# EAGLE design YPORT+_Oberteil (EAGLE 7.5.0)
Assembly variants: <unbenannt>
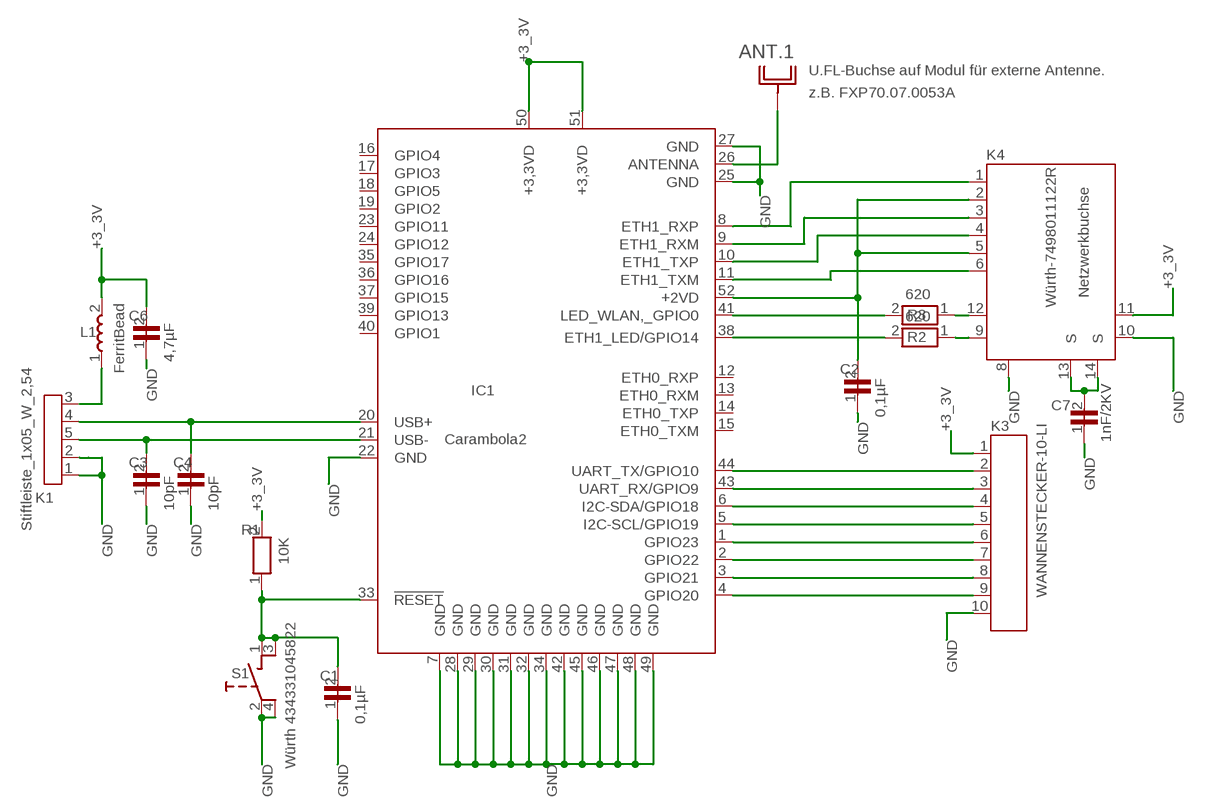
[diagram p0: schematic, sheet 1]

## Parts
ANT.1  Antennensteckdose  ANTENNENSTECKDOSE  (no package)
C1  0,1µF  [0603_KLEIN]
C2  0,1µF  [0603_KLEIN]
C3  10pF  10PF  [0603_KLEIN]
C4  10pF  10PF  [0603_KLEIN]
C6  4,7µF  [0603_KLEIN]
C7  1nF/2KV  1NF/2KV  [1206]
IC1  Carambola2  CARAMBOLA2  [CARAMBOLA2]
K1  Stiftleiste_1x05_W_2,54  STIFTLEISTE_1X05_W_2,54  [STIFTLEISTE_1X05_G_2,54]
K3  WANNENSTECKER-10-LI  [WANNENSTECKER-10-LI]
K4  Würth-7498011122R  WÜRTH-7498011122R  [WÜRTH-7498011122R]
L1  FerritBead  FERRITBEAD  [0805_KLEIN]
R1  10K  [0603_KLEIN]
R2  620  [0603_KLEIN]
R3  620  [0603_KLEIN]
S1  Würth 434331045822  WÜRTH_434331045822  [PTVF-TASTER]

## Nets
1: K4.12 R3.1
2: C3.2 IC1.21(USB-) K1.5
3: C4.2 IC1.20(USB+) K1.4
4: K1.3 L1.1
+2VD: C2.2 IC1.52(+2VD) K4.2 K4.5
+3_3V: C6.2 IC1.50(+3,3VD) IC1.51(+3,3VD) K3.1 K4.11 L1.2 R1.2
ANTENNA: ANT.1.1 IC1.26(ANTENNA)
ETH1_RXM: IC1.9(ETH1_RXM) K4.3
ETH1_RXP: IC1.8(ETH1_RXP) K4.1
ETH1_TXM: IC1.11(ETH1_TXM) K4.6
ETH1_TXP: IC1.10(ETH1_TXP) K4.4
GND: C1.1 C2.1 C3.1 C4.1 C6.1 C7.1 IC1.7(GND) IC1.22(GND) IC1.25(GND) IC1.27(GND) IC1.28(GND) IC1.29(GND) IC1.30(GND) IC1.31(GND) IC1.32(GND) IC1.34(GND) IC1.42(GND) IC1.45(GND) IC1.46(GND) IC1.47(GND) IC1.48(GND) IC1.49(GND) K1.1 K1.2 K3.10 K4.8 K4.10 S1.2 S1.4
GPIO14: IC1.41(LED_WLAN,_GPIO0) R3.2
GPIO20: IC1.4(GPIO20) K3.9
GPIO21: IC1.3(GPIO21) K3.8
GPIO22: IC1.2(GPIO22) K3.7
GPIO23: IC1.1(GPIO23) K3.6
I2C/GPIO19: IC1.5(I2C-SCL/GPIO19) K3.5
SIG$5: C1.2 IC1.33(!RESET) R1.1 S1.1 S1.3
SIG$12: IC1.38(ETH1_LED/GPIO14) R2.2
SIG$15: IC1.6(I2C-SDA/GPIO18) K3.4
SIG$17: C7.2 K4.13(S) K4.14(S)
SIG$19: K4.9 R2.1
UART_RX/GPIO9: IC1.43(UART_RX/GPIO9) K3.3
UART_TX/GPIO10: IC1.44(UART_TX/GPIO10) K3.2
Unconnected: IC1.12(ETH0_RXP) IC1.13(ETH0_RXM) IC1.14(ETH0_TXP) IC1.15(ETH0_TXM) IC1.16(GPIO4) IC1.17(GPIO3) IC1.18(GPIO5) IC1.19(GPIO2) IC1.23(GPIO11) IC1.24(GPIO12) IC1.35(GPIO17) IC1.36(GPIO16) IC1.37(GPIO15) IC1.39(GPIO13) IC1.40(GPIO1)

## Notes on the sheet
- U.FL-Buchse auf Modul für externe Antenne.
- z.B. FXP70.07.0053A
- Netzwerkbuchse

## Library data of the parts
ANT.1 = TARGET3001!_V31.8.0.48:ANTENNENSTECKDOSE: Antennensteckdose
C1 C2 = TARGET3001!_V31.8.0.48:0,1µF
C3 C4 = TARGET3001!_V31.8.0.48:10PF
C6 = TARGET3001!_V31.8.0.48:4,7µF
C7 = TARGET3001!_V31.8.0.48:1NF/2KV: SMD VS KONDENSATOR 0.1 UF 1206 50 V SMD-Vielschicht-Keramik-Kondensatoren Nennspannung 50 V - 1 pF - 1000 pF NPO; 1200 pF -1 µF X7R. Toleranz 1 pF ... 1000 pF: 5%; 1200 pF ... 1 µF: ±10%. Baugröße 1206 ; Wert 0,1 µ
IC1 = TARGET3001!_V31.8.0.48:CARAMBOLA2
K1 = TARGET3001!_V31.8.0.48:STIFTLEISTE_1X05_W_2,54: Stiftleiste
K3 = TARGET3001!_V31.8.0.48:WANNENSTECKER-10-LI: Wannenstecker für abgewinkelte Print-Montage 2x5-polig
K4 = TARGET3001!_V31.8.0.48:WÜRTH-7498011122R
L1 = TARGET3001!_V31.8.0.48:FERRITBEAD: Miniatur Festinduktivität 10µH, R=0,55
R1 = TARGET3001!_V31.8.0.48:10K: Widerstand, allgemein
R2 R3 = TARGET3001!_V31.8.0.48:620: Widerstand, allgemein
S1 = TARGET3001!_V31.8.0.48:WÜRTH_434331045822: KURZHUBTAST. -vertikkaler EINBAU Kurzhubtaster für Durchsteckmontage Technische Daten: Schaltleistung: 50 mA/12 V= - Übergangswiderstand: 100 mOhm max. - Isolationswiderstand: 100 MOhm min. - Spannungsfestigkeit: 250 V~ min. (1 Minute) - Elektrische Lebensdauer (Zyklen): 100.000 - Horizontaler Einbau - Betätigungskraft: 1,6 N ±0,5 N/Hub 0,25 mm - Arbeitstemp. -20 bis +70 °C - Lagertemp. -30 bis +80 °C - Vibrationen: 10 - 500 Hz/10 g - Schwallbadlötung: 255 °C, 5 sec. max. - Handlötung: 300 °C, 3 sec. max. - Ausführung: Drucktaster - Polzahl: einpolig. APEM Nr. PHAP3305A ; Schaltstellung AUS - TAST (EIN) ; Abm. (L) 3,85 m

## Board
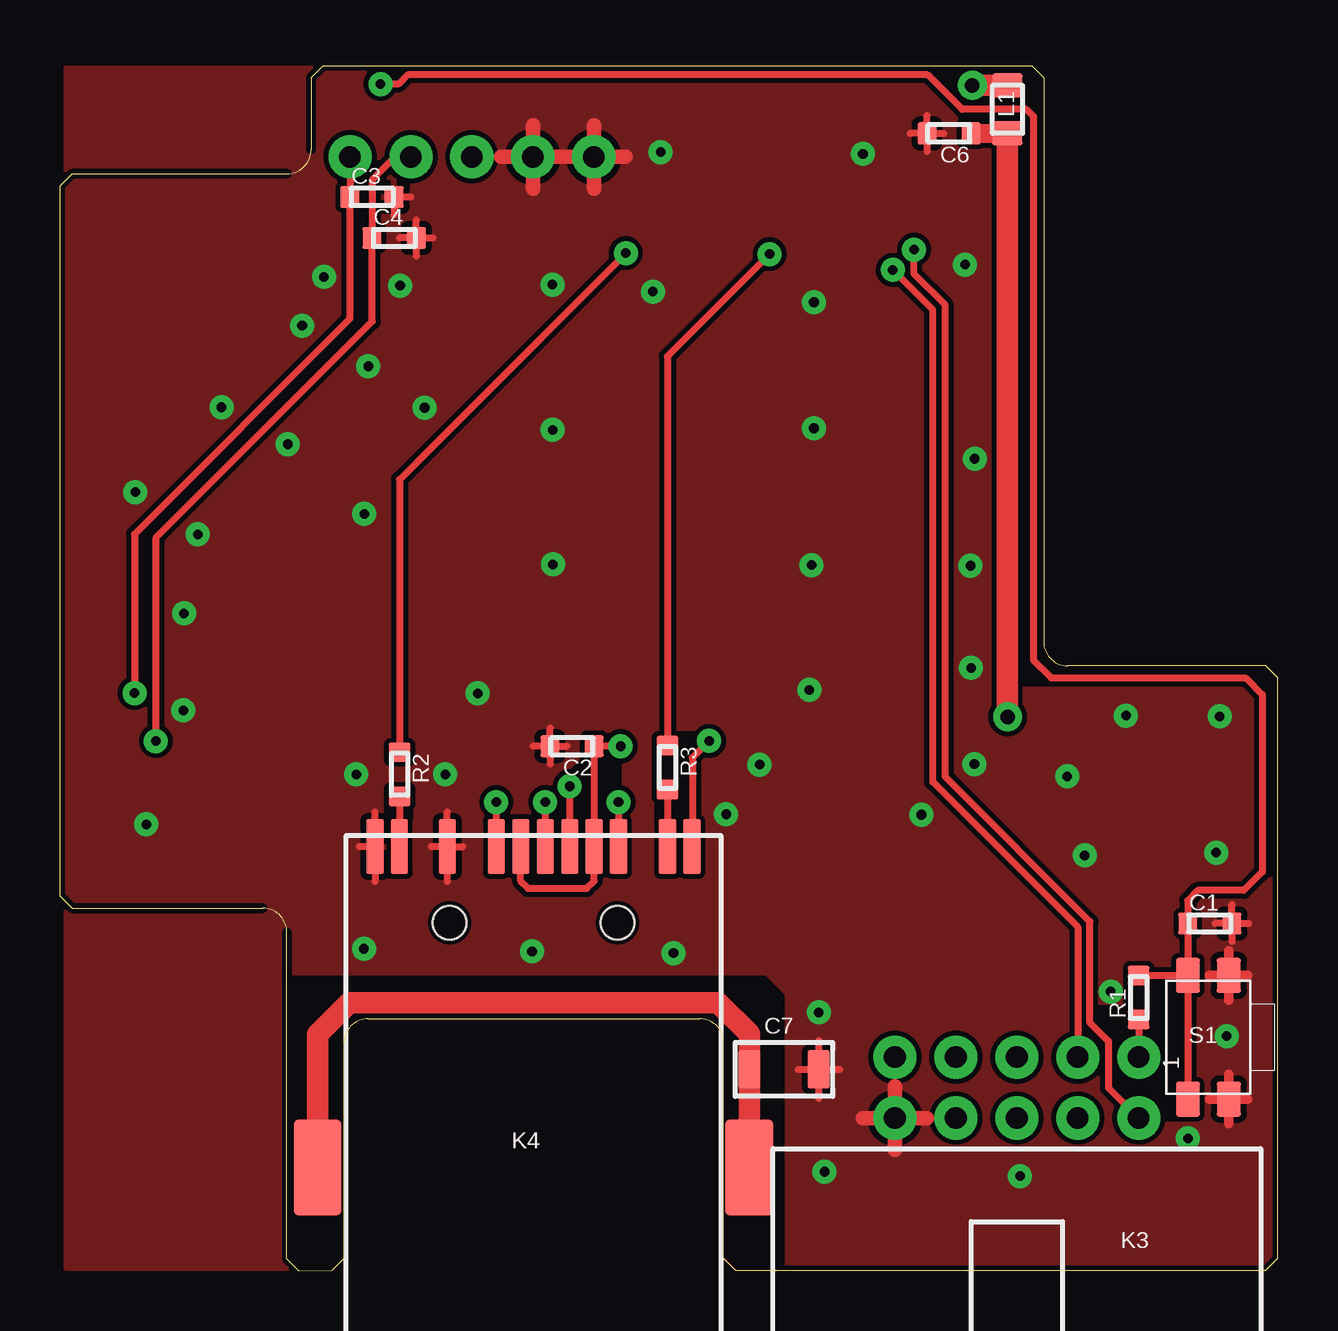
[diagram p1: board, top side]
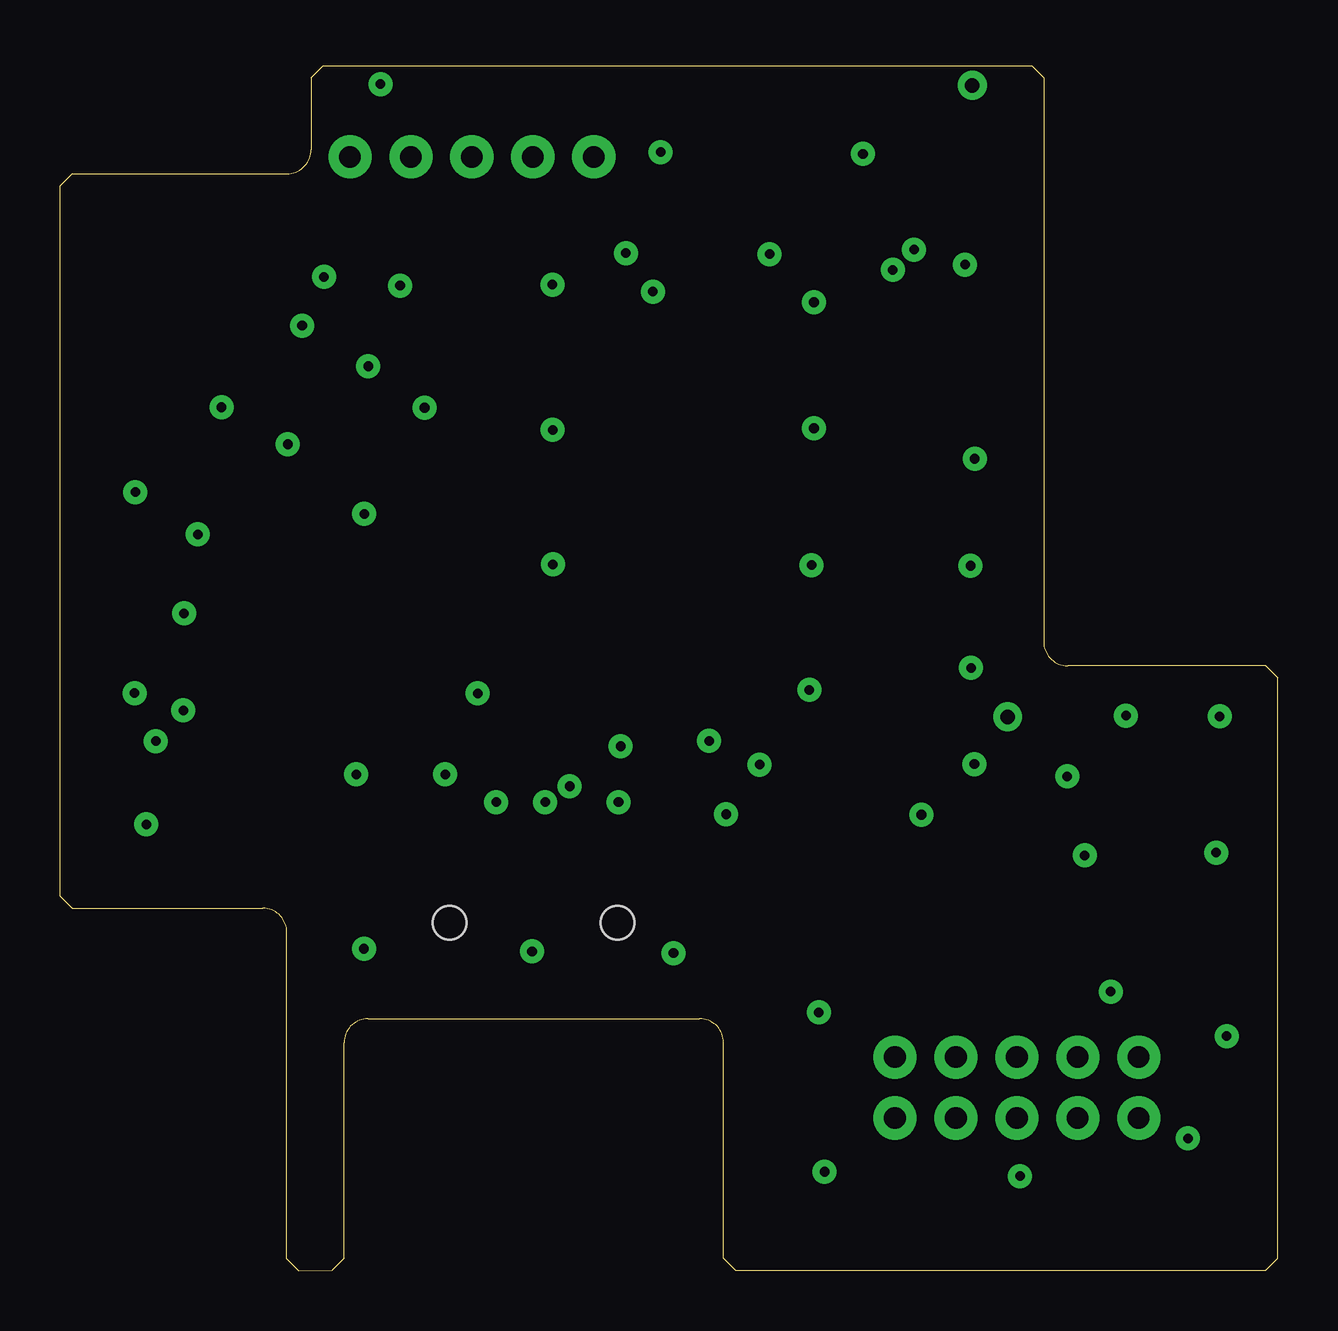
[diagram p2: board, inner layer 2]
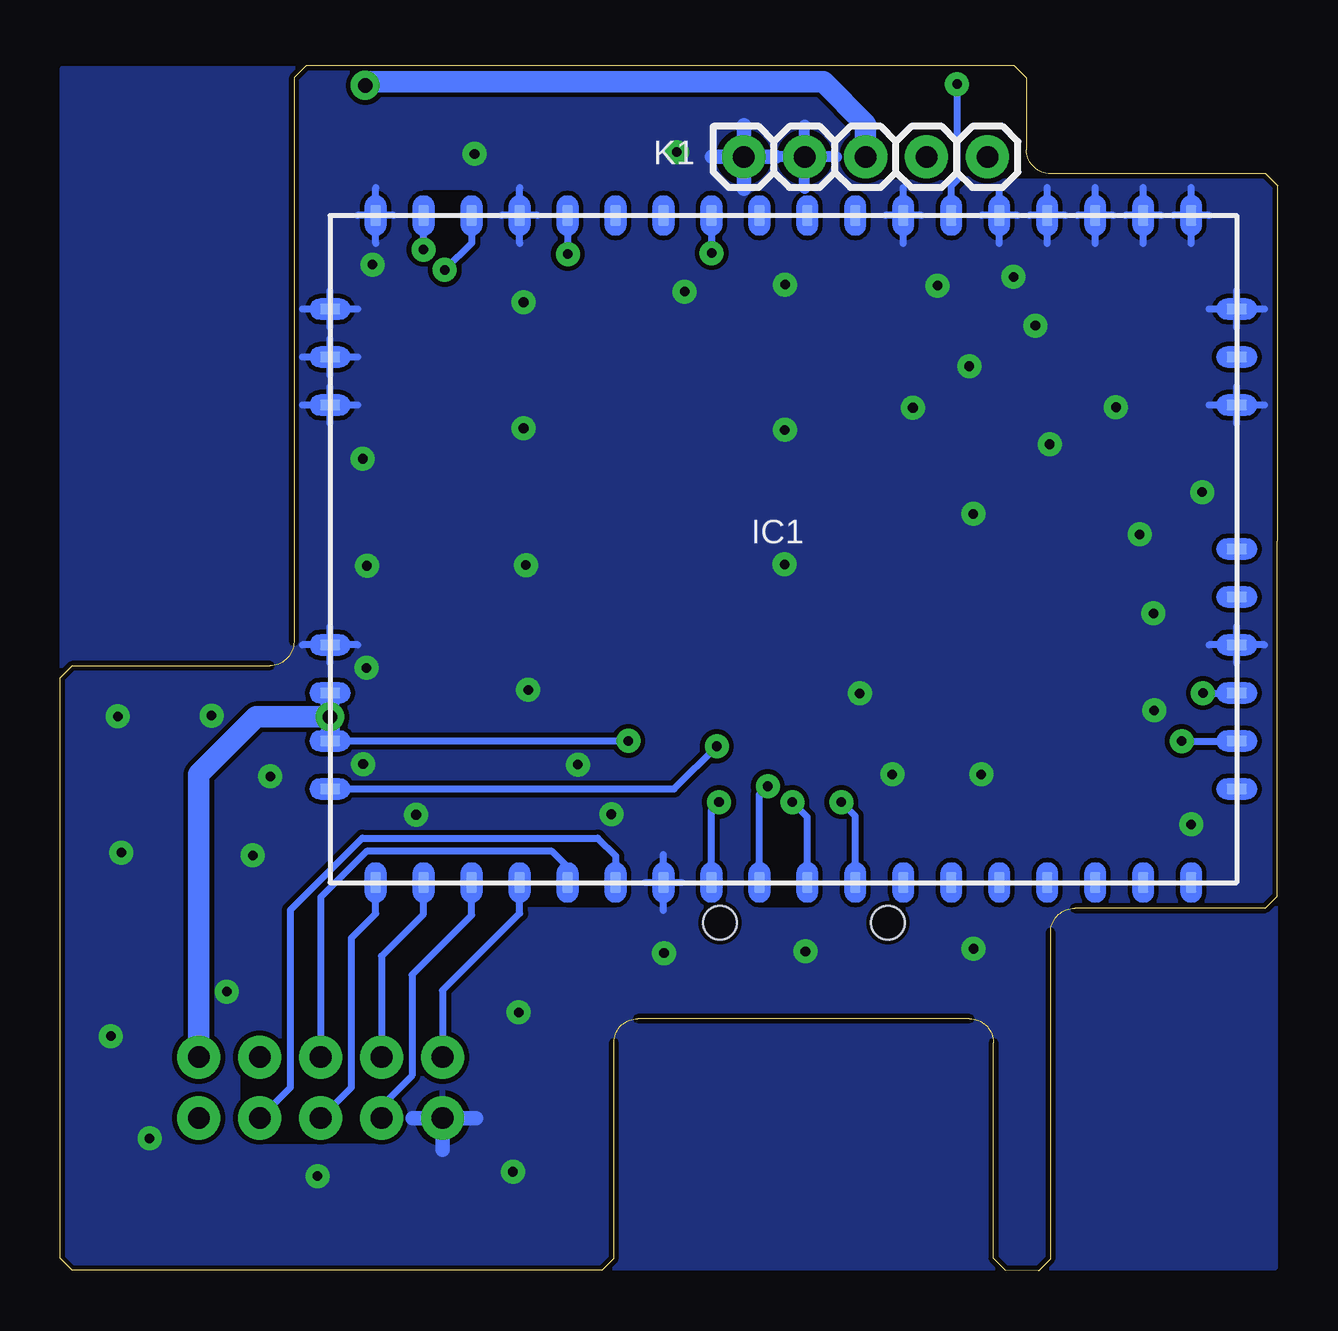
[diagram p3: board, bottom side, seen from below]

Size 50.75 x 50.21 mm. Coordinates in mm from the lower left corner, seen from the top.
Outline: 50.75,0.51 50.75,24.71 50.25,25.21 42,25.21 arc-90 41,26.21 41,49.71 40.5,50.21 10.96,50.21 10.46,49.71 10.46,46.71 arc-90 9.46,45.71 0.5,45.71 0,45.21 0.01,15.61 0.51,15.1 8.46,15.1 arc-90 9.46,14.1 9.46,0.49 9.95,0 11.34,0.01 11.84,0.51 11.84,9.5 arc-90 12.84,10.5 26.66,10.5 arc-90 27.66,9.5 27.66,0.51 28.16,0.01 50.25,0.01 50.75,0.51
Copper layers (1*16): Top 0.035mm / dielectric 1.5mm / Bottom 0.035mm
Design rules "TARGET3001!": minimum track width 0.2mm, minimum drill 0.4mm, track to track 0.2mm, track to pad 0.2mm, pad to pad 0.2mm, via to via 0.2mm, smd to smd 0.2mm, copper to edge 0mm, drill to drill 0.3mm, minimum pad ring 0.45mm, minimum via ring 0.3mm, stop-mask expansion 4mil, vias tented up to drill 0mil, thermal gap 10mil

### Footprints (pad centres in the part's own frame; a part is rotated, then mirrored left to right if it is on the bottom)
0603_KLEIN = smd 0.8 x 0.9: 1 -0.917,0; 2 0.917,0
1206 = smd 0.9 x 1.6: 1 -1.45,0; 2 1.45,0
CARAMBOLA2 = smd 0.85 x 0.45: 1 0,0; 2 0,-1.999; 3 0,-4.001; 4 0,-6; 5 0,-8.001; 6 0,-10; 7 0,-11.999; 8 0,-14.001; 9 0,-15.999; 10 0,-17.996; 11 0,-19.995; 12 0,-21.996; 13 0,-23.995; 14 0,-25.997; 15 0,-27.996; 16 0,-29.995; 17 0,-31.996; 18 0,-33.995; 28 27.795,-33.995; 29 27.795,-31.996; 30 27.795,-29.995; 31 27.795,-27.996; 32 27.795,-25.997; 33 27.795,-23.995; 34 27.795,-21.996; 35 27.795,-19.995; 36 27.795,-17.996; 37 27.795,-15.999; 38 27.795,-14.001; 39 27.795,-11.999; 40 27.795,-10; 41 27.795,-8.001; 42 27.795,-6; 43 27.795,-4.001; 44 27.795,-1.999; 45 27.795,0 | smd 0.45 x 0.85: 19 3.901,-35.895; 20 5.9,-35.895; 21 7.899,-35.895; 22 9.901,-35.895; 23 11.9,-35.895; 24 13.899,-35.895; 25 19.896,-35.895; 26 21.897,-35.895; 27 23.896,-35.895; 46 23.896,1.9; 47 21.897,1.9; 48 19.896,1.9; 49 9.901,1.9; 50 7.899,1.9; 51 5.9,1.9; 52 3.901,1.9
STIFTLEISTE_1X05_G_2,54 = drill 0.9 pad 1.8 round: 1 0,0; 2 2.54,0; 3 5.08,0; 4 7.62,0; 5 10.16,0
WANNENSTECKER-10-LI = drill 0.9 pad 1.8 round: 1 -5.08,-1.27; 2 -5.08,1.27; 3 -2.54,-1.27; 4 -2.54,1.27; 5 0,-1.27; 6 0,1.27; 7 2.54,-1.27; 8 2.54,1.27; 9 5.08,-1.27; 10 5.08,1.27
WÜRTH-7498011122R = smd 0.71 x 2.29: 1 3.545,8.17; 2 2.525,8.17; 3 1.505,8.17; 4 0.485,8.17; 5 -0.535,8.17; 6 -1.555,8.17; 8 -3.595,8.17; 9 -5.585,8.17; 10 -6.605,8.17; 11 6.605,8.17; 12 5.585,8.17 | smd 2 x 4: 13 8.989,-5.21; 14 -8.998,-5.21 | hole 1.4: 3.5,4.99; -3.5,4.99
0805_KLEIN = smd 1 x 1.25: 1 1,0; 2 -1,0
PTVF-TASTER = smd 1.45 x 1: 1 -2.575,2.6; 2 -2.575,0.9; 3 2.575,2.6; 4 2.575,0.9

### Placement (x,y rotation side)
C1  47.93,14.46 180 top
C2  21.34,21.85 0 top
C3  13.01,44.74 180 top
C4  13.93,43.03 180 top
C6  37.06,47.38 0 top
C7  30.18,8.38 180 top
IC1  37.59,16.17 90 bottom
K1  22.25,46.41 0 bottom
K3  39.88,7.62 180 top
K4  19.74,9.5 0 top
L1  39.49,48.38 90 top
R1  44.96,11.38 270 top
R2  14.15,20.68 90 top
R3  25.32,20.96 90 top
S1  49.61,9.72 90 top

### Tracks (layer width: path | path; a pad name or v marks a point on that pad's centre or on a via)
1
  Top 0.3: R3.1 K4.12
2  (via drill 0.4 pad 1)
  Top 0.3: C3.2 | C3.2 12.09,39.67 3.11,30.69 v3.11,24.07 | K1.5 C3.2
  Bottom 0.3: v3.11,24.07 IC1.21
3  (via drill 0.4 pad 1)
  Top 0.3: v3.99,22.06 3.99,30.53 13.01,39.55 C4.2 13.01,45.45 13.97,46.41 K1.4
  Bottom 0.3: v3.99,22.06 IC1.20
4  (via drill 0.6 pad 1.2)
  Top 0.9: v38.03,49.38 L1.1
  Bottom 0.9: K1.3 17.17,47.77 18.94,49.54 37.87,49.54 v38.03,49.38
+2VD  (via drill 0.4 pad 1)
  Top 0.3: C2.2 | K4.5 19.2,16.23 19.51,15.92 21.96,15.92 22.26,16.23 K4.2 C2.2 v23.37,21.85 v23.36,21.85 | C2.2
  Bottom 0.3: IC1.52 25.15,20.07 v23.37,21.85 23.28,21.75
+3_3V  (via drill 0.4 pad 1, 0.6 pad 1.2)
  Top 0.3: R1.2 K3.1 | v27.06,22.07 26.36,21.38 26.36,17.69 26.35,17.69
  Top 0.8: C6.2 L1.2
  Top 0.9: v39.5,23.07 L1.2
  Top 1: L1.2
  Bottom 0.3: IC1.51 v27.06,22.07
  Bottom 0.8: IC1.50 v39.5,23.07 IC1.51
  Bottom 0.9: v39.5,23.07 42.57,23.07 44.96,20.68 K3.1
ANTENNA
  cutout Top: 3.1,-14.49 3.09,-14.49 3.08,-14.49 3.08,-14.5 3.08,-14.51 3.09,-14.51 3.1,-14.52 3.11,-14.51 3.11,-14.51 3.11,-14.5
  cutout Top: 29.39,12.27 29.4,12.27 29.4,12.28 29.4,12.29 29.39,12.29 9.25,12.29 9.24,12.29 9.24,12.28 9.24,12.27 9.25,12.27
  cutout Top: 29.4,12.29 29.39,12.29 29.38,12.29 29.38,12.28 29.38,12.27 30.18,11.47 30.19,11.47 30.2,11.47 30.2,11.48 30.2,11.49
  cutout Top: 30.18,0.14 30.18,0.13 30.19,0.12 30.2,0.13 30.2,0.14 30.2,11.48 30.2,11.49 30.19,11.49 30.18,11.49 30.18,11.48
  cutout Bottom: 15,45.49 15,45.49 14.99,45.48 15,45.47 15,45.46 16.65,45.46 16.66,45.47 16.66,45.48 16.66,45.49 16.65,45.49
  cutout Bottom: 35.59,44.99 35.6,45 35.6,45 35.6,45.01 35.59,45.02 33.6,45.02 33.59,45.01 33.59,45 33.59,45 33.6,44.99
  cutout Bottom: 35.6,45 35.61,45.01 35.6,45.02 35.59,45.02 35.59,45.02 35.58,45.01 35.58,45 35.58,45 35.59,44.99 35.6,45
  cutout Bottom: 43.2,6.78 43.2,6.77 43.21,6.77 43.22,6.77 43.22,6.78 43.22,8.34 43.22,8.35 43.21,8.35 43.2,8.35 43.2,8.34
  cutout Bottom: 43.2,6.78 43.19,6.77 43.2,6.77 43.2,6.76 43.21,6.77 43.22,6.77 43.22,6.78 43.22,6.79 43.21,6.79 43.2,6.79
  cutout Bottom: 31.46,15.16 31.47,15.16 31.48,15.17 31.47,15.18 31.46,15.18 29.61,15.18 29.6,15.18 29.6,15.17 29.6,15.16 29.61,15.16
  cutout Bottom: 31.47,15.14 31.48,15.14 31.49,15.14 31.49,15.15 31.49,15.16 31.47,15.18 31.46,15.18 31.46,15.18 31.45,15.17 31.46,15.16
  cutout Bottom: 29.6,15.14 29.61,15.14 29.62,15.15 29.61,15.16 29.6,15.16 27.6,15.16 27.59,15.16 27.59,15.15 27.59,15.14 27.6,15.14
  cutout Bottom: 29.62,15.15 29.62,15.16 29.62,15.17 29.61,15.17 29.6,15.17 29.6,15.16 29.59,15.15 29.6,15.14 29.6,15.14 29.61,15.14
  cutout Top: 26.55,22.45 26.55,22.45 26.56,22.46 26.55,22.47 26.55,22.48 25.83,22.48 25.82,22.47 25.82,22.46 25.82,22.45 25.83,22.45
  cutout Top: 24.68,20.48 24.68,20.47 24.69,20.47 24.7,20.47 24.7,20.48 24.7,21.43 24.7,21.44 24.69,21.44 24.68,21.44 24.68,21.43
  cutout Top: 21.67,21.26 21.67,21.25 21.68,21.24 21.69,21.25 21.69,21.26 21.69,21.37 21.69,21.37 21.68,21.38 21.67,21.37 21.67,21.37
  cutout Top: 21.27,20.86 21.27,20.86 21.27,20.85 21.28,20.84 21.29,20.85 21.69,21.25 21.69,21.26 21.69,21.26 21.68,21.27 21.67,21.26
  cutout Top: 13.51,18.95 13.51,18.94 13.52,18.94 13.53,18.94 13.53,18.95 13.53,19.31 13.53,19.32 13.52,19.33 13.51,19.32 13.51,19.31
  cutout Top: 24.8,19.5 24.79,19.51 24.78,19.52 24.78,19.51 24.77,19.5 24.77,18.87 24.78,18.86 24.78,18.85 24.79,18.86 24.8,18.87
  cutout Top: 24.8,19.5 24.79,19.51 24.78,19.52 24.78,19.51 24.77,19.5 24.78,19.49 24.78,19.49 24.79,19.49
  cutout Top: 23.37,20.12 23.38,20.11 23.39,20.11 23.39,20.11 23.4,20.12 23.4,21.2 23.39,21.21 23.39,21.22 23.38,21.21 23.37,21.2
  cutout Top: 23.4,20.12 23.39,20.13 23.39,20.13 23.38,20.13 23.37,20.12 23.38,20.11 23.39,20.11 23.39,20.11
  cutout Top: 40.05,24.37 40.04,24.37 40.03,24.36 40.04,24.35 40.05,24.35 41.42,24.35 41.42,24.35 41.43,24.36 41.42,24.37 41.42,24.37
  cutout Top: 40.02,24.4 40.02,24.4 40.01,24.4 40,24.39 40.01,24.38 40.04,24.35 40.05,24.35 40.05,24.35 40.06,24.36 40.05,24.37
  cutout Top: 45.95,6.26 45.94,6.27 45.93,6.26 45.93,6.25 45.93,6.24 45.95,6.23 45.96,6.22 45.96,6.23 45.97,6.24 45.96,6.24
  cutout Top: 37.68,8.03 37.67,8.04 37.66,8.03 37.66,8.03 37.66,8.02 37.69,7.98 37.7,7.98 37.71,7.98 37.71,7.99 37.71,8
  cutout Bottom: 9.55,45.54 9.55,45.54 9.54,45.53 9.55,45.52 9.55,45.52 11.55,45.52 11.55,45.52 11.56,45.53 11.55,45.54 11.55,45.54
  cutout Bottom: 9.56,45.54 9.55,45.55 9.54,45.54 9.54,45.53 9.54,45.53 9.55,45.52 9.55,45.52 9.56,45.52 9.57,45.53 9.56,45.54
  cutout Bottom: 21.59,15.15 21.6,15.15 21.6,15.16 21.6,15.17 21.59,15.17 19.61,15.17 19.6,15.17 19.6,15.16 19.6,15.15 19.61,15.15
  cutout Bottom: 21.61,15.16 21.61,15.17 21.61,15.18 21.6,15.18 21.59,15.18 21.58,15.17 21.58,15.16 21.58,15.15 21.59,15.15 21.6,15.15
  cutout Bottom: 39.83,5.3 39.84,5.3 39.84,5.31 39.84,5.32 39.83,5.32 37.28,5.32 37.27,5.32 37.27,5.31 37.27,5.3 37.28,5.3
  cutout Bottom: 39.85,5.31 39.86,5.32 39.85,5.33 39.84,5.33 39.83,5.33 39.82,5.32 39.82,5.31 39.82,5.3 39.83,5.3 39.84,5.3
  cutout Bottom: 42.38,5.29 42.39,5.29 42.4,5.3 42.39,5.31 42.38,5.31 39.8,5.31 39.79,5.31 39.79,5.3 39.79,5.29 39.8,5.29
  cutout Bottom: 42.39,5.28 42.4,5.27 42.4,5.28 42.41,5.29 42.4,5.3 42.39,5.31 42.38,5.31 42.38,5.31 42.37,5.3 42.38,5.29
  cutout Top: 43.16,11.05 43.15,11.05 43.15,11.04 43.15,11.03 43.16,11.03 44.39,11.03 44.4,11.03 44.4,11.04 44.4,11.05 44.39,11.05
  cutout Top: 46.82,6.23 46.83,6.23 46.83,6.24 46.83,6.25 46.82,6.25 45.82,6.25 45.81,6.25 45.81,6.24 45.81,6.23 45.82,6.23
  cutout Top: 44.35,11.92 44.34,11.93 44.34,11.93 44.33,11.93 44.32,11.92 44.32,10.94 44.33,10.94 44.34,10.93 44.34,10.94 44.35,10.94
  cutout Top: 14.71,19.3 14.71,19.31 14.7,19.31 14.69,19.31 14.69,19.3 14.69,18.88 14.69,18.87 14.7,18.87 14.71,18.87 14.71,18.88
  cutout Bottom: 50.95,24.71 50.89,24.85 50.75,24.91 50.61,24.85 50.55,24.71 50.55,0.51 50.61,0.36 50.75,0.31 50.89,0.36 50.95,0.51
  cutout layer 2: 50.95,24.71 50.89,24.85 50.75,24.91 50.61,24.85 50.55,24.71 50.55,0.51 50.61,0.36 50.75,0.31 50.89,0.36 50.95,0.51
  cutout layer 2: 50.95,24.71 50.89,24.85 50.75,24.91 50.61,24.85 50.55,24.71 50.55,0.51 50.61,0.36 50.75,0.31 50.89,0.36 50.95,0.51
  cutout Top: 50.95,24.71 50.89,24.85 50.75,24.91 50.61,24.85 50.55,24.71 50.55,0.51 50.61,0.36 50.75,0.31 50.89,0.36 50.95,0.51
  cutout Bottom: 42,25.41 41.86,25.35 41.8,25.21 41.86,25.07 42,25.01 50.25,25.01 50.39,25.07 50.45,25.21 50.39,25.35 50.25,25.41
  cutout layer 2: 42,25.41 41.86,25.35 41.8,25.21 41.86,25.07 42,25.01 50.25,25.01 50.39,25.07 50.45,25.21 50.39,25.35 50.25,25.41
  cutout layer 2: 42,25.41 41.86,25.35 41.8,25.21 41.86,25.07 42,25.01 50.25,25.01 50.39,25.07 50.45,25.21 50.39,25.35 50.25,25.41
  cutout Top: 42,25.41 41.86,25.35 41.8,25.21 41.86,25.07 42,25.01 50.25,25.01 50.39,25.07 50.45,25.21 50.39,25.35 50.25,25.41
  cutout Bottom: 40.8,26.21 40.86,26.07 41,26.01 41.14,26.07 41.2,26.21 41.2,49.71 41.14,49.85 41,49.91 40.86,49.85 40.8,49.71
  cutout layer 2: 40.8,26.21 40.86,26.07 41,26.01 41.14,26.07 41.2,26.21 41.2,49.71 41.14,49.85 41,49.91 40.86,49.85 40.8,49.71
  cutout layer 2: 40.8,26.21 40.86,26.07 41,26.01 41.14,26.07 41.2,26.21 41.2,49.71 41.14,49.85 41,49.91 40.86,49.85 40.8,49.71
  cutout Top: 40.8,26.21 40.86,26.07 41,26.01 41.14,26.07 41.2,26.21 41.2,49.71 41.14,49.85 41,49.91 40.86,49.85 40.8,49.71
  cutout Bottom: 40.5,50.01 40.64,50.06 40.7,50.21 40.64,50.35 40.5,50.41 10.96,50.41 10.82,50.35 10.76,50.21 10.82,50.06 10.96,50.01
  cutout layer 2: 40.5,50.01 40.64,50.06 40.7,50.21 40.64,50.35 40.5,50.41 10.96,50.41 10.82,50.35 10.76,50.21 10.82,50.06 10.96,50.01
  cutout layer 2: 40.5,50.01 40.64,50.06 40.7,50.21 40.64,50.35 40.5,50.41 10.96,50.41 10.82,50.35 10.76,50.21 10.82,50.06 10.96,50.01
  cutout Top: 40.5,50.01 40.64,50.06 40.7,50.21 40.64,50.35 40.5,50.41 10.96,50.41 10.82,50.35 10.76,50.21 10.82,50.06 10.96,50.01
  cutout Bottom: 10.26,46.71 10.32,46.56 10.46,46.51 10.61,46.56 10.66,46.71 10.66,49.71 10.61,49.85 10.46,49.91 10.32,49.85 10.26,49.71
  cutout layer 2: 10.26,46.71 10.32,46.56 10.46,46.51 10.61,46.56 10.66,46.71 10.66,49.71 10.61,49.85 10.46,49.91 10.32,49.85 10.26,49.71
  cutout layer 2: 10.26,46.71 10.32,46.56 10.46,46.51 10.61,46.56 10.66,46.71 10.66,49.71 10.61,49.85 10.46,49.91 10.32,49.85 10.26,49.71
  cutout Top: 10.26,46.71 10.32,46.56 10.46,46.51 10.61,46.56 10.66,46.71 10.66,49.71 10.61,49.85 10.46,49.91 10.32,49.85 10.26,49.71
  cutout Bottom: 9.46,45.51 9.61,45.56 9.66,45.71 9.61,45.85 9.46,45.91 0.5,45.91 0.36,45.85 0.3,45.71 0.36,45.56 0.5,45.51
  cutout layer 2: 9.46,45.51 9.61,45.56 9.66,45.71 9.61,45.85 9.46,45.91 0.5,45.91 0.36,45.85 0.3,45.71 0.36,45.56 0.5,45.51
  cutout layer 2: 9.46,45.51 9.61,45.56 9.66,45.71 9.61,45.85 9.46,45.91 0.5,45.91 0.36,45.85 0.3,45.71 0.36,45.56 0.5,45.51
  cutout Top: 9.46,45.51 9.61,45.56 9.66,45.71 9.61,45.85 9.46,45.91 0.5,45.91 0.36,45.85 0.3,45.71 0.36,45.56 0.5,45.51
  cutout Bottom: 0.2,45.21 0.14,45.35 0,45.41 -0.14,45.35 -0.2,45.21 -0.19,15.61 -0.13,15.46 0.01,15.41 0.15,15.47 0.21,15.61
  cutout layer 2: 0.2,45.21 0.14,45.35 0,45.41 -0.14,45.35 -0.2,45.21 -0.19,15.61 -0.13,15.46 0.01,15.41 0.15,15.47 0.21,15.61
  cutout layer 2: 0.2,45.21 0.14,45.35 0,45.41 -0.14,45.35 -0.2,45.21 -0.19,15.61 -0.13,15.46 0.01,15.41 0.15,15.47 0.21,15.61
  cutout Top: 0.2,45.21 0.14,45.35 0,45.41 -0.14,45.35 -0.2,45.21 -0.19,15.61 -0.13,15.46 0.01,15.41 0.15,15.47 0.21,15.61
  cutout Bottom: 8.46,14.9 8.6,14.96 8.66,15.1 8.6,15.24 8.46,15.3 0.51,15.3 0.37,15.24 0.31,15.1 0.37,14.96 0.51,14.9
  cutout layer 2: 8.46,14.9 8.6,14.96 8.66,15.1 8.6,15.24 8.46,15.3 0.51,15.3 0.37,15.24 0.31,15.1 0.37,14.96 0.51,14.9
  cutout layer 2: 8.46,14.9 8.6,14.96 8.66,15.1 8.6,15.24 8.46,15.3 0.51,15.3 0.37,15.24 0.31,15.1 0.37,14.96 0.51,14.9
  cutout Top: 8.46,14.9 8.6,14.96 8.66,15.1 8.6,15.24 8.46,15.3 0.51,15.3 0.37,15.24 0.31,15.1 0.37,14.96 0.51,14.9
  cutout Bottom: 9.66,14.1 9.6,14.24 9.46,14.3 9.32,14.24 9.26,14.1 9.26,0.49 9.32,0.35 9.46,0.29 9.6,0.35 9.66,0.49
  cutout layer 2: 9.66,14.1 9.6,14.24 9.46,14.3 9.32,14.24 9.26,14.1 9.26,0.49 9.32,0.35 9.46,0.29 9.6,0.35 9.66,0.49
  cutout layer 2: 9.66,14.1 9.6,14.24 9.46,14.3 9.32,14.24 9.26,14.1 9.26,0.49 9.32,0.35 9.46,0.29 9.6,0.35 9.66,0.49
  cutout Top: 9.66,14.1 9.6,14.24 9.46,14.3 9.32,14.24 9.26,14.1 9.26,0.49 9.32,0.35 9.46,0.29 9.6,0.35 9.66,0.49
  cutout Bottom: 50.89,0.37 50.95,0.51 50.89,0.65 50.75,0.71 50.61,0.65 50.11,0.15 50.05,0.01 50.11,-0.13 50.25,-0.19 50.39,-0.13
  cutout layer 2: 50.89,0.37 50.95,0.51 50.89,0.65 50.75,0.71 50.61,0.65 50.11,0.15 50.05,0.01 50.11,-0.13 50.25,-0.19 50.39,-0.13
  cutout layer 2: 50.89,0.37 50.95,0.51 50.89,0.65 50.75,0.71 50.61,0.65 50.11,0.15 50.05,0.01 50.11,-0.13 50.25,-0.19 50.39,-0.13
  cutout Top: 50.89,0.37 50.95,0.51 50.89,0.65 50.75,0.71 50.61,0.65 50.11,0.15 50.05,0.01 50.11,-0.13 50.25,-0.19 50.39,-0.13
  cutout Bottom: 9.6,0.63 9.46,0.69 9.32,0.63 9.26,0.49 9.32,0.35 9.81,-0.14 9.95,-0.2 10.09,-0.14 10.15,0 10.09,0.14
  cutout layer 2: 9.6,0.63 9.46,0.69 9.32,0.63 9.26,0.49 9.32,0.35 9.81,-0.14 9.95,-0.2 10.09,-0.14 10.15,0 10.09,0.14
  cutout layer 2: 9.6,0.63 9.46,0.69 9.32,0.63 9.26,0.49 9.32,0.35 9.81,-0.14 9.95,-0.2 10.09,-0.14 10.15,0 10.09,0.14
  cutout Top: 9.6,0.63 9.46,0.69 9.32,0.63 9.26,0.49 9.32,0.35 9.81,-0.14 9.95,-0.2 10.09,-0.14 10.15,0 10.09,0.14
  cutout Bottom: 0.15,15.75 0.01,15.81 -0.13,15.75 -0.19,15.61 -0.13,15.47 0.37,14.96 0.51,14.9 0.66,14.96 0.71,15.1 0.66,15.24
  cutout layer 2: 0.15,15.75 0.01,15.81 -0.13,15.75 -0.19,15.61 -0.13,15.47 0.37,14.96 0.51,14.9 0.66,14.96 0.71,15.1 0.66,15.24
  cutout layer 2: 0.15,15.75 0.01,15.81 -0.13,15.75 -0.19,15.61 -0.13,15.47 0.37,14.96 0.51,14.9 0.66,14.96 0.71,15.1 0.66,15.24
  cutout Top: 0.15,15.75 0.01,15.81 -0.13,15.75 -0.19,15.61 -0.13,15.47 0.37,14.96 0.51,14.9 0.66,14.96 0.71,15.1 0.66,15.24
  cutout Bottom: -0.14,45.35 -0.2,45.21 -0.14,45.07 0,45.01 0.14,45.07 0.64,45.57 0.7,45.71 0.64,45.85 0.5,45.91 0.36,45.85
  cutout layer 2: -0.14,45.35 -0.2,45.21 -0.14,45.07 0,45.01 0.14,45.07 0.64,45.57 0.7,45.71 0.64,45.85 0.5,45.91 0.36,45.85
  cutout layer 2: -0.14,45.35 -0.2,45.21 -0.14,45.07 0,45.01 0.14,45.07 0.64,45.57 0.7,45.71 0.64,45.85 0.5,45.91 0.36,45.85
  cutout Top: -0.14,45.35 -0.2,45.21 -0.14,45.07 0,45.01 0.14,45.07 0.64,45.57 0.7,45.71 0.64,45.85 0.5,45.91 0.36,45.85
  cutout Bottom: 11.11,50.07 11.16,50.21 11.11,50.35 10.96,50.41 10.82,50.35 10.32,49.85 10.26,49.71 10.32,49.57 10.46,49.51 10.61,49.57
  cutout layer 2: 11.11,50.07 11.16,50.21 11.11,50.35 10.96,50.41 10.82,50.35 10.32,49.85 10.26,49.71 10.32,49.57 10.46,49.51 10.61,49.57
  cutout layer 2: 11.11,50.07 11.16,50.21 11.11,50.35 10.96,50.41 10.82,50.35 10.32,49.85 10.26,49.71 10.32,49.57 10.46,49.51 10.61,49.57
  cutout Top: 11.11,50.07 11.16,50.21 11.11,50.35 10.96,50.41 10.82,50.35 10.32,49.85 10.26,49.71 10.32,49.57 10.46,49.51 10.61,49.57
  cutout Bottom: 40.86,49.57 41,49.51 41.14,49.57 41.2,49.71 41.14,49.85 40.64,50.35 40.5,50.41 40.36,50.35 40.3,50.21 40.36,50.07
  cutout layer 2: 40.86,49.57 41,49.51 41.14,49.57 41.2,49.71 41.14,49.85 40.64,50.35 40.5,50.41 40.36,50.35 40.3,50.21 40.36,50.07
  cutout layer 2: 40.86,49.57 41,49.51 41.14,49.57 41.2,49.71 41.14,49.85 40.64,50.35 40.5,50.41 40.36,50.35 40.3,50.21 40.36,50.07
  cutout Top: 40.86,49.57 41,49.51 41.14,49.57 41.2,49.71 41.14,49.85 40.64,50.35 40.5,50.41 40.36,50.35 40.3,50.21 40.36,50.07
  cutout Bottom: 50.61,24.57 50.75,24.51 50.89,24.57 50.95,24.71 50.89,24.85 50.39,25.35 50.25,25.41 50.11,25.35 50.05,25.21 50.11,25.07
  cutout layer 2: 50.61,24.57 50.75,24.51 50.89,24.57 50.95,24.71 50.89,24.85 50.39,25.35 50.25,25.41 50.11,25.35 50.05,25.21 50.11,25.07
  cutout layer 2: 50.61,24.57 50.75,24.51 50.89,24.57 50.95,24.71 50.89,24.85 50.39,25.35 50.25,25.41 50.11,25.35 50.05,25.21 50.11,25.07
  cutout Top: 50.61,24.57 50.75,24.51 50.89,24.57 50.95,24.71 50.89,24.85 50.39,25.35 50.25,25.41 50.11,25.35 50.05,25.21 50.11,25.07
  cutout Bottom: 27.86,9.5 27.8,9.64 27.66,9.7 27.52,9.64 27.46,9.5 27.46,0.51 27.52,0.36 27.66,0.31 27.8,0.36 27.86,0.51
  cutout layer 2: 27.86,9.5 27.8,9.64 27.66,9.7 27.52,9.64 27.46,9.5 27.46,0.51 27.52,0.36 27.66,0.31 27.8,0.36 27.86,0.51
  cutout layer 2: 27.86,9.5 27.8,9.64 27.66,9.7 27.52,9.64 27.46,9.5 27.46,0.51 27.52,0.36 27.66,0.31 27.8,0.36 27.86,0.51
  cutout Top: 27.86,9.5 27.8,9.64 27.66,9.7 27.52,9.64 27.46,9.5 27.46,0.51 27.52,0.36 27.66,0.31 27.8,0.36 27.86,0.51
  cutout Bottom: 26.66,10.3 26.8,10.36 26.86,10.5 26.8,10.64 26.66,10.7 12.84,10.7 12.7,10.64 12.64,10.5 12.7,10.36 12.84,10.3
  cutout layer 2: 26.66,10.3 26.8,10.36 26.86,10.5 26.8,10.64 26.66,10.7 12.84,10.7 12.7,10.64 12.64,10.5 12.7,10.36 12.84,10.3
  cutout layer 2: 26.66,10.3 26.8,10.36 26.86,10.5 26.8,10.64 26.66,10.7 12.84,10.7 12.7,10.64 12.64,10.5 12.7,10.36 12.84,10.3
  cutout Top: 26.66,10.3 26.8,10.36 26.86,10.5 26.8,10.64 26.66,10.7 12.84,10.7 12.7,10.64 12.64,10.5 12.7,10.36 12.84,10.3
  cutout Bottom: 12.04,9.5 11.98,9.64 11.84,9.7 11.7,9.64 11.64,9.5 11.64,0.51 11.7,0.36 11.84,0.31 11.98,0.36 12.04,0.51
  cutout layer 2: 12.04,9.5 11.98,9.64 11.84,9.7 11.7,9.64 11.64,9.5 11.64,0.51 11.7,0.36 11.84,0.31 11.98,0.36 12.04,0.51
  cutout layer 2: 12.04,9.5 11.98,9.64 11.84,9.7 11.7,9.64 11.64,9.5 11.64,0.51 11.7,0.36 11.84,0.31 11.98,0.36 12.04,0.51
  cutout Top: 12.04,9.5 11.98,9.64 11.84,9.7 11.7,9.64 11.64,9.5 11.64,0.51 11.7,0.36 11.84,0.31 11.98,0.36 12.04,0.51
  cutout Bottom: 11.34,-0.19 11.48,-0.13 11.54,0.01 11.48,0.15 11.34,0.21 9.95,0.2 9.81,0.14 9.75,0 9.81,-0.14 9.95,-0.2
  cutout layer 2: 11.34,-0.19 11.48,-0.13 11.54,0.01 11.48,0.15 11.34,0.21 9.95,0.2 9.81,0.14 9.75,0 9.81,-0.14 9.95,-0.2
  cutout layer 2: 11.34,-0.19 11.48,-0.13 11.54,0.01 11.48,0.15 11.34,0.21 9.95,0.2 9.81,0.14 9.75,0 9.81,-0.14 9.95,-0.2
  cutout Top: 11.34,-0.19 11.48,-0.13 11.54,0.01 11.48,0.15 11.34,0.21 9.95,0.2 9.81,0.14 9.75,0 9.81,-0.14 9.95,-0.2
  cutout Bottom: 50.25,-0.19 50.39,-0.13 50.45,0.01 50.39,0.15 50.25,0.21 28.16,0.21 28.02,0.15 27.96,0.01 28.02,-0.13 28.16,-0.19
  cutout layer 2: 50.25,-0.19 50.39,-0.13 50.45,0.01 50.39,0.15 50.25,0.21 28.16,0.21 28.02,0.15 27.96,0.01 28.02,-0.13 28.16,-0.19
  cutout layer 2: 50.25,-0.19 50.39,-0.13 50.45,0.01 50.39,0.15 50.25,0.21 28.16,0.21 28.02,0.15 27.96,0.01 28.02,-0.13 28.16,-0.19
  cutout Top: 50.25,-0.19 50.39,-0.13 50.45,0.01 50.39,0.15 50.25,0.21 28.16,0.21 28.02,0.15 27.96,0.01 28.02,-0.13 28.16,-0.19
  cutout Bottom: 27.8,0.65 27.66,0.71 27.52,0.65 27.46,0.51 27.52,0.37 28.02,-0.13 28.16,-0.19 28.3,-0.13 28.36,0.01 28.3,0.15
  cutout layer 2: 27.8,0.65 27.66,0.71 27.52,0.65 27.46,0.51 27.52,0.37 28.02,-0.13 28.16,-0.19 28.3,-0.13 28.36,0.01 28.3,0.15
  cutout layer 2: 27.8,0.65 27.66,0.71 27.52,0.65 27.46,0.51 27.52,0.37 28.02,-0.13 28.16,-0.19 28.3,-0.13 28.36,0.01 28.3,0.15
  cutout Top: 27.8,0.65 27.66,0.71 27.52,0.65 27.46,0.51 27.52,0.37 28.02,-0.13 28.16,-0.19 28.3,-0.13 28.36,0.01 28.3,0.15
  cutout Bottom: 11.2,0.15 11.14,0.01 11.2,-0.13 11.34,-0.19 11.48,-0.13 11.98,0.37 12.04,0.51 11.98,0.65 11.84,0.71 11.7,0.65
  cutout layer 2: 11.2,0.15 11.14,0.01 11.2,-0.13 11.34,-0.19 11.48,-0.13 11.98,0.37 12.04,0.51 11.98,0.65 11.84,0.71 11.7,0.65
  cutout layer 2: 11.2,0.15 11.14,0.01 11.2,-0.13 11.34,-0.19 11.48,-0.13 11.98,0.37 12.04,0.51 11.98,0.65 11.84,0.71 11.7,0.65
  cutout Top: 11.2,0.15 11.14,0.01 11.2,-0.13 11.34,-0.19 11.48,-0.13 11.98,0.37 12.04,0.51 11.98,0.65 11.84,0.71 11.7,0.65
ETH1_RXM  (via drill 0.4 pad 1)
  Top 0.3: v21.25,20.18 K4.3
  Bottom 0.3: IC1.9 21.59,19.84 v21.25,20.18
ETH1_RXP  (via drill 0.4 pad 1)
  Top 0.3: v23.28,19.52 K4.1
  Bottom 0.3: IC1.8 23.59,19.21 v23.28,19.52
ETH1_TXM  (via drill 0.4 pad 1)
  Top 0.3: v18.18,19.52 K4.6
  Bottom 0.3: IC1.11 17.6,18.94 v18.18,19.52
ETH1_TXP  (via drill 0.4 pad 1)
  Top 0.3: v20.22,19.52 K4.4
  Bottom 0.3: IC1.10 19.6,18.9 v20.22,19.52
GND  (via drill 0.4 pad 1)
  Top 0.3: 13.92,43.99 C3.1 14.62,44.74 | C4.1 14.85,42.28 | C4.1 15.55,43.03 | C4.1 14.85,43.78 | C1.1 49.54,14.46 | C1.1 48.14,14.46 | C1.1 48.84,13.71 | C2.1 20.43,21.1 | C2.1 19.73,21.85 | C2.1 20.43,22.6 | C2.1 21.13,21.85 | K4.8 16.8,17.67 | K4.8 16.14,19.11 | K4.8 15.49,17.67 | K4.8 16.14,16.22 | K4.10 13.13,19.11 | K4.10 12.48,17.67 | K4.10 13.13,16.22 | C6.1 36.84,47.38 | C6.1 36.14,48.13 | C6.1 35.44,47.38 | C6.1 36.14,46.63 | C4.1 14.15,43.03 | 49.52,12.3 49.54,12.3 | 48.72,13.32 48.72,13.35 | 49.52,7.15 49.54,7.15 | 48.72,8.17 48.72,8.2 | 47.89,12.3 47.91,12.3 | 48.72,11.25 48.72,11.27 | 47.89,7.15 47.91,7.15 | 48.72,6.1 48.72,6.12 | 32.49,8.38 32.38,8.38 C7.1 | 31.63,9.59 31.63,9.48 C7.1 | C7.1 30.88,8.38 30.77,8.38 | C7.1 31.63,7.28 31.63,7.17 | 48.84,15.26 48.84,15.21 C1.1
  Top 0.4: 47.91,12.3 S1.4 | 48.72,11.27 S1.4 | 47.91,7.15 S1.2 | 48.72,6.12 S1.2 | S1.4 49.52,12.3 | S1.4 48.72,13.32 | S1.2 49.52,7.15 | S1.2 48.72,8.17
  Top 0.6: K1.1 21.05,46.41 21.04,46.41 20.93,46.41 20.91,46.41 K1.2 | 23.57,46.41 23.45,46.41 K1.1 | K1.1 22.25,45.21 22.25,45.08 | 36.13,6.35 36,6.35 K3.10 | 34.8,7.68 34.8,7.55 K3.10 | K3.10 33.6,6.35 33.48,6.35 | K3.10 34.8,5.15 34.8,5.03 | 22.25,47.73 22.25,47.61 K1.1 | 19.71,47.73 19.71,47.61 K1.2 | K1.2 18.51,46.41 18.38,46.41 | K1.2 19.71,45.21 19.71,45.08
  Bottom 0.3: 2.86,26.07 2.85,26.07 IC1.22 | 1.7,26.83 1.7,26.82 IC1.22 | IC1.22 0.55,26.07 0.54,26.07 | IC1.22 1.7,25.32 1.7,25.31 | 2.86,36.07 2.85,36.07 IC1.25 | 1.7,36.83 1.7,36.82 IC1.25 | IC1.25 0.55,36.07 0.54,36.07 | IC1.25 1.7,35.32 1.7,35.3 | 2.86,40.07 2.85,40.07 IC1.27 | 1.7,40.83 1.7,40.82 IC1.27 | IC1.27 0.55,40.07 0.54,40.07 | IC1.27 1.7,39.32 1.7,39.3 | 4.36,43.96 4.35,43.96 IC1.28 | 3.6,45.13 3.6,45.11 IC1.28 | IC1.28 2.85,43.96 2.84,43.96 | IC1.28 3.6,42.81 3.6,42.8 | 6.36,43.96 6.35,43.96 IC1.29 | 5.6,45.13 5.6,45.11 IC1.29 | IC1.29 4.85,43.96 4.83,43.96 | IC1.29 5.6,42.81 5.6,42.8 | 8.36,43.96 8.35,43.96 IC1.30 | 7.6,45.13 7.6,45.11 IC1.30 | IC1.30 6.85,43.96 6.84,43.96 | IC1.30 7.6,42.81 7.6,42.8 | 10.36,43.96 10.35,43.96 IC1.31 | 9.6,45.13 9.6,45.11 IC1.31 | IC1.31 8.85,43.96 8.83,43.96 | IC1.31 9.6,42.81 9.6,42.8 | 12.36,43.96 12.35,43.96 IC1.32 | 11.6,45.13 11.6,45.11 IC1.32 | IC1.32 10.85,43.96 10.83,43.96 | IC1.32 11.6,42.81 11.6,42.8 | 16.36,43.96 16.35,43.96 IC1.34 | 15.6,45.13 15.6,45.11 IC1.34 | IC1.34 14.85,43.96 14.84,43.96 | IC1.34 15.6,42.81 15.6,42.8 | 32.36,43.96 32.34,43.96 IC1.42 | 31.59,45.13 31.59,45.11 IC1.42 | IC1.42 30.84,43.96 30.83,43.96 | IC1.42 31.59,42.81 31.59,42.8 | 38.36,43.96 38.34,43.96 IC1.45 | 37.59,45.13 37.59,45.11 IC1.45 | IC1.45 36.84,43.96 36.83,43.96 | IC1.45 37.59,42.81 37.59,42.8 | 40.66,40.07 40.64,40.07 IC1.46 | 39.49,40.83 39.49,40.82 IC1.46 | IC1.46 38.34,40.07 38.33,40.07 | IC1.46 39.49,39.32 39.49,39.3 | 40.66,38.07 40.64,38.07 IC1.47 | 39.49,38.83 39.49,38.82 IC1.47 | IC1.47 38.34,38.07 38.33,38.07 | IC1.47 39.49,37.32 39.49,37.3 | 40.66,36.07 40.64,36.07 IC1.48 | 39.49,36.83 39.49,36.82 IC1.48
  Bottom 0.3: IC1.48 38.34,36.07 38.33,36.07 | IC1.48 39.49,35.32 39.49,35.3 | 40.66,26.07 40.64,26.07 IC1.49 | 39.49,26.83 39.49,26.82 IC1.49 | IC1.49 38.34,26.07 38.33,26.07 | IC1.49 39.49,25.32 39.49,25.31 | 26.36,16.17 26.34,16.17 IC1.7 | 25.59,17.33 25.59,17.32 IC1.7 | IC1.7 24.84,16.17 24.83,16.17 | IC1.7 25.59,15.02 25.59,15.01
  Bottom 0.45: 21.04,46.41 20.93,46.41 20.91,46.41 K1.2 | 19.71,47.73 19.71,47.61 K1.2 | K1.2 18.51,46.41 18.38,46.41 | K1.2 19.71,45.21 19.71,45.08
  Bottom 0.6: K1.1 21.05,46.41 21.04,46.41 20.93,46.41 | 23.57,46.41 23.45,46.41 K1.1 | K1.1 22.25,45.21 22.25,45.08 | 36.05,6.35 36,6.35 K3.10 | K3.10 33.6,6.35 33.4,6.35 | K3.10 34.8,5.15 34.8,5.03 | 22.25,47.73 22.25,47.61 K1.1
  other vias: 3.6,18.59 14.18,41.04 12.85,37.68 9.49,34.43 5.74,30.67 5.17,27.39 5.14,23.34 3.14,32.44 6.73,35.97 10.09,39.37 11,41.41 37.73,41.92 38.13,33.83 37.95,29.37 37.97,25.11 38.12,21.1 43.79,11.63 48.63,9.77 47.01,5.51 40.02,3.93 31.87,4.12 31.63,10.75 25.57,13.23 19.68,13.3 12.67,13.41 31.43,40.35 31.43,35.1 31.33,29.4 31.23,24.2 24.71,40.8 20.54,35.03 20.55,29.43 17.41,24.05 16.05,20.68 25.04,46.6 33.47,46.53 20.52,41.08 48.33,23.09 44.43,23.12 48.19,17.42 35.91,19 27.77,19.01 29.16,21.09 12.35,20.67 12.69,31.53 15.2,35.95 41.98,20.6 42.71,17.3
  pour Bottom (isolate 0.2): 50.65,50.11 0.1,50.11 0.1,0.11 50.65,0.11 50.65,50.11
  pour Top (isolate 0.2): 50.79,50.1 0.24,50.1 0.24,0.1 50.79,0.1 50.79,50.1
GPIO14  (via drill 0.4 pad 1)
  Top 0.3: v29.58,42.35 25.32,38.09 R3.2
  Bottom 0.3: IC1.41 29.59,42.37 v29.58,42.35
GPIO20
  Bottom 0.3: IC1.4 31.59,14.89 34.8,11.67 K3.9
GPIO21
  Bottom 0.3: IC1.3 33.59,14.81 36.07,12.33 36.07,8.12 37.34,6.85 K3.8
GPIO22
  Bottom 0.3: IC1.2 35.59,14.86 37.34,13.11 K3.7
GPIO23
  Bottom 0.3: IC1.1 37.59,14.87 38.61,13.85 38.61,7.63 K3.6
I2C/GPIO19
  Bottom 0.3: IC1.5 29.59,16.83 30.24,17.47 37.97,17.47 39.88,15.56 K3.5
SIG$5  (via drill 0.4 pad 1)
  Top 0.3: R1.1 S1.3 | S1.3 47.01,12.31 | S1.3 S1.1 | 47.01,12.31 C1.2 47.01,15.42 47.43,15.84 49.34,15.84 50.12,16.62 50.12,24 49.42,24.7 41.31,24.7 40.57,25.44 40.57,48.1 40.28,48.39 37.61,48.39 36.18,49.82 14.49,49.82 14.11,49.44 v13.36,49.44 | 47.01,12.31 S1.3
  Bottom 0.3: IC1.33 13.6,45.2 13.35,45.45 v13.35,49.44 v13.36,49.44
SIG$12  (via drill 0.4 pad 1)
  Top 0.3: v23.59,42.39 14.15,32.96 R2.2
  Bottom 0.3: IC1.38 v23.59,42.39
SIG$15
  Bottom 0.3: K3.4 41.15,7.63 41.15,15.02 38.16,18.02 28.33,18.02 27.59,17.28 IC1.6
SIG$16
  Top 0.3: 17.18,46.4 17.17,46.41
SIG$17
  Top 0.9: K4.14 10.74,9.84 12.06,11.16 27.43,11.16 28.73,9.86 C7.2 K4.13 | K4.13 28.66,4.29 | K4.13 28.75,4.29
SIG$19
  Top 0.3: R2.1 K4.9
UART_RX/GPIO9  (via drill 0.4 pad 1)
  Top 0.3: 42.35,8.89 K3.3 42.42,14.32 36.38,20.37 36.38,40.03 v34.71,41.7
  Bottom 0.3: IC1.43 33.59,42.81 v34.71,41.7
UART_TX/GPIO10  (via drill 0.4 pad 1)
  Top 0.3: v35.6,42.55 35.6,41.53 36.9,40.24 36.9,20.58 42.94,14.54 42.94,10.32 43.7,9.56 43.7,7.62 K3.2
  Bottom 0.3: IC1.44 v35.59,42.56 v35.6,42.55